# Altium project YatCPU.PrjPcb
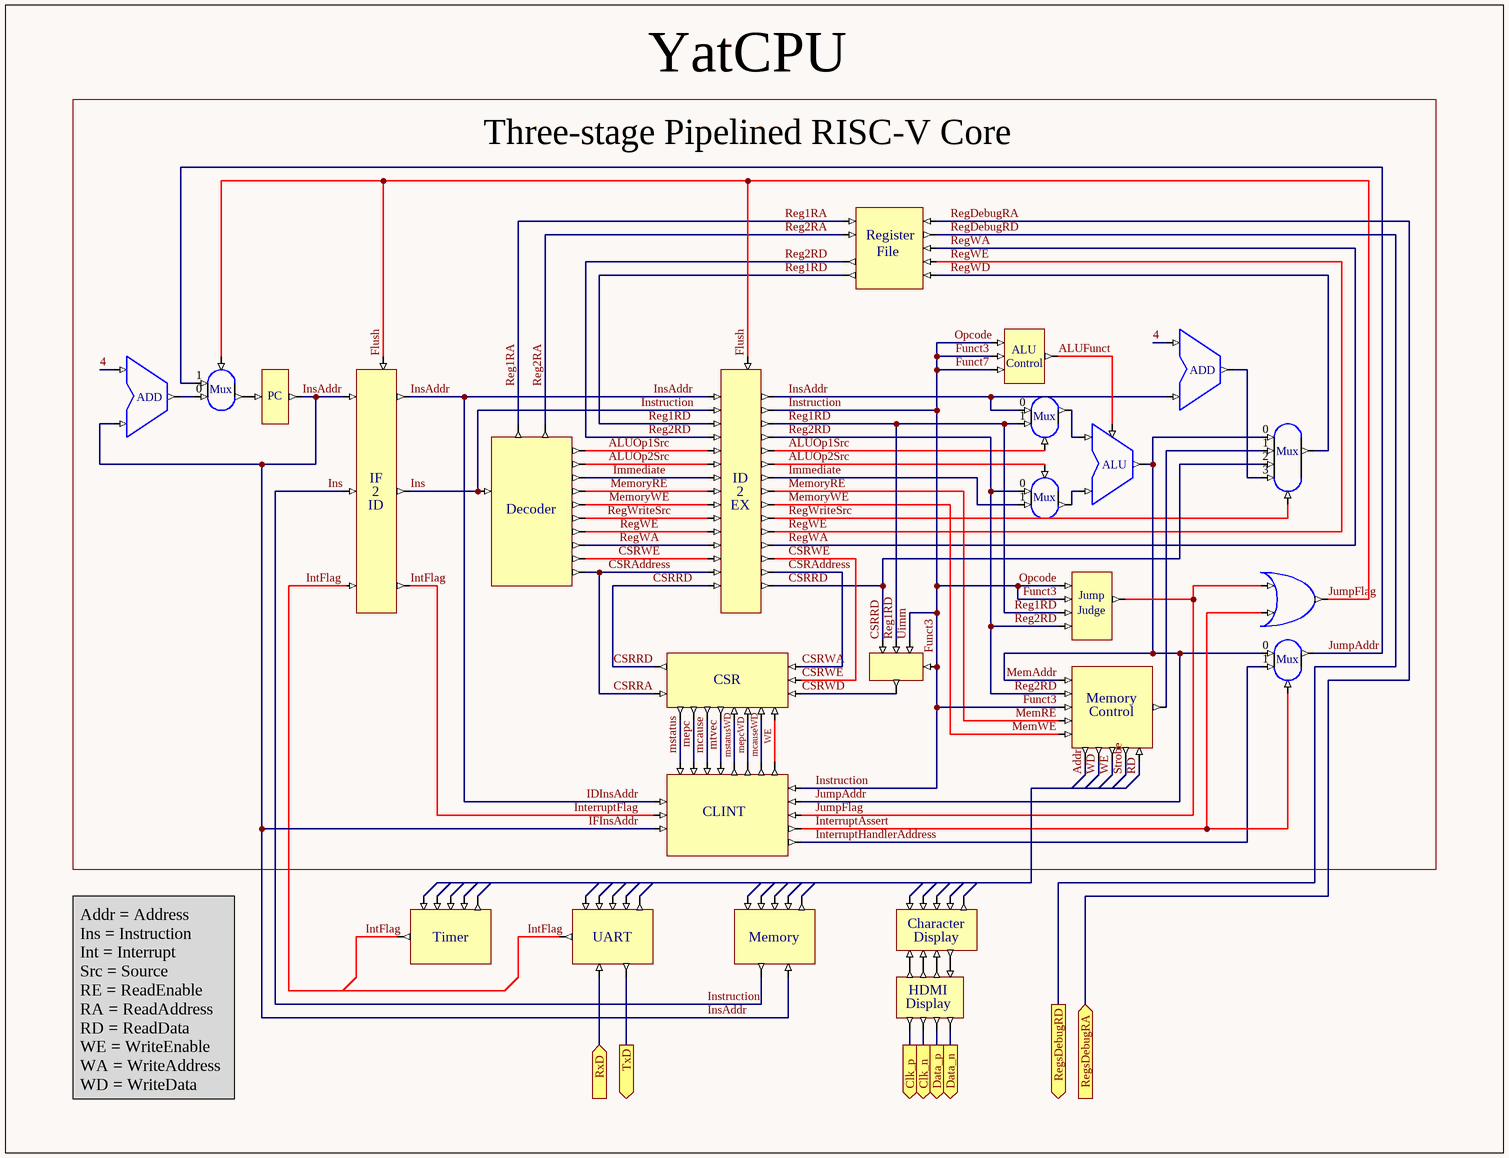
[diagram p0: ThreeStagePipelineCPU.SchDoc]
2 sheets, 54 parts. Net scope: flat (ports and power ports of the same name join across sheets).
Sheets:
  ThreeStagePipelineCPU.SchDoc
  FiveStagePipenlineCPU.SchDoc

## Sheet ThreeStagePipelineCPU.SchDoc
size 281 x 215 mm

### Parts
(Parts that share a designator on the sheet are numbered #1, #2 ... from top to bottom, then left to right.)
*#1  RegFile  (value not drawn)
*#2  ALUControl  (value not drawn)
*#3  ADD  (value not drawn)
*#4  ADD  (value not drawn)
*#5  Mux2  (value not drawn)
*#6  Mux2‘  (value not drawn)
*#7  ALU  (value not drawn)
*#8  Mux4  (value not drawn)
*#9  JumpJudge  (value not drawn)
*#10  OR  (value not drawn)
*#11  Mux2‘  (value not drawn)
*#12  CSR  (value not drawn)
*#13  CSRCompute  (value not drawn)
*#14  MemoryControl  (value not drawn)
*#15  CLINT  (value not drawn)
*#16  Timer  (value not drawn)
*#17  UART  (value not drawn)
*#18  Memory  (value not drawn)
*#19  CharacterDisplay  (value not drawn)
*#20  HDMIDisplay  (value not drawn)
*?#1  Mux2  (value not drawn)
ID  ID  (value not drawn)
ID/EX  PipelineReg14  (value not drawn)
IF/ID#1  PipelineReg3  (value not drawn)
Reg1  PC

### Blocks framed on the sheet
YatCPU: *#1-*#15 *?#1 ID ID/EX IF/ID#1 Reg1

### Ports
Clk_n (out), Clk_p (out), Data_n (out), Data_p (out), RegsDebugRA (in), RegsDebugRD (out), RxD (in), TxD (out)

### Nets
4: *#3.0(in0) *#4.0(in0)
Addr: *#14.10
ALUFunct: *#2.41 *#7.3
ALUOp1Src: *#6.3(select) ID.22 ID/EX.16 ID/EX.26
ALUOp2Src: *?#1.3(select) ID.14 ID/EX.17 ID/EX.27
CSRAddress: *#12.22 *#12.28 ID.23 ID/EX.6 ID/EX.34  [also labelled CSRWA]
CSRRD: *#8.2(in1) *#12.27 *#13.37 ID/EX.5(in) ID/EX.8
CSRWD: *#12.24 *#13.40
CSRWE: *#12.23 ID.21 ID/EX.11 ID/EX.33
Flush: *#5.3(select) *#9.40 *#10.1 *#10.3 *#15.23 ID/EX.10(FlushEnable) IF/ID#1.10  [also labelled JumpFlag]
Funct3: *#2.38 *#2.39 *#2.40 *#9.38 *#9.39 *#13.38 *#13.39 *#14.6 *#15.26 *#18.45 ID.11 ID/EX.13 ID/EX.23 IF/ID#1.3(in) IF/ID#1.7  [also labelled Funct7, Ins, Instruction, Opcode, Uimm]
IDInsAddr: *#3.1(in1) *#4.1(in1) *#6.0(in0) *#15.27 *#15.28 *#18.46 ID/EX.2(in) ID/EX.12 IF/ID#1.2(in) IF/ID#1.6 Reg1.1(OUT)  [also labelled IFInsAddr, InsAddr]
Immediate: *?#1.1(in1) ID.15 ID/EX.18 ID/EX.28
InterruptAssert: *#10.2 *#11.3(select) *#15.24
InterruptFlag: *#15.29 IF/ID#1.8  [also labelled IntFlag]
InterruptHandlerAddress: *#11.1(in1) *#15.25
JumpAddr: *#5.1(in0) *#7.2(out) *#8.0(in0) *#11.0(in0) *#11.2(out) *#14.4 *#15.22  [also labelled MemAddr]
mcause: *#12.30 *#15.16
mcauseWD: *#12.34 *#15.20
MemoryRE: *#14.7 ID.16 ID/EX.3(in) ID/EX.7  [also labelled MemRE]
MemoryWE: *#14.8 ID.17 ID/EX.19 ID/EX.29  [also labelled MemWE]
mepc: *#12.29 *#15.15
mepcWD: *#12.33 *#15.19
mstatus: *#12.29 *#15.15
mstatusWD: *#12.32 *#15.18
mtvec: *#12.31 *#15.17
RD: *#14.13
Reg1RA: *#1.28 ID.12
Reg1RD: *#1.31 *#6.1(in1) *#9.36 *#13.36 ID/EX.14 ID/EX.24
Reg2RA: *#1.29 ID.13
Reg2RD: *#1.30 *#9.37 *#14.5 *?#1.0(in0) ID/EX.15 ID/EX.25
RegDebugRA: *#1.35 ; port RegsDebugRA
RegDebugRD: *#1.36 ; port RegsDebugRD
RegWA: *#1.32 ID.20 ID/EX.22 ID/EX.32
RegWD: *#1.34 *#8.4(out)
RegWE: *#1.33 ID.19 ID/EX.21 ID/EX.31
RegWriteSrc: *#8.5(select) ID.18 ID/EX.20 ID/EX.30
Strobe: *#14.11
WD: *#14.14
WE: *#12.35 *#14.12 *#15.21
Net*#3_2: *#3.2(out) *#8.3(in3)
Net*#4_2: *#4.2(out) *#5.0(in1)
Net*#5_2: *#5.2(out) Reg1.0(IN)
Net*#6_2: *#6.2(out) *#7.0(in0)
Net*#7_1: *#7.1(in1) *?#1.2(out)
Net*#8_1: *#8.1(in1) *#14.9
Net*#17_46: *#17.46 ; port RxD
Net*#17_47: *#17.47 ; port TxD
Net*#19_45: *#19.45 *#20.44
Net*#19_46: *#19.46 *#20.43
Net*#19_47: *#19.47 *#20.43
Net*#19_48: *#19.48 *#20.43
Net*#20_45: *#20.45 ; port Data_n
Net*#20_46: *#20.46 ; port Clk_p
Net*#20_47: *#20.47 ; port Clk_n
Net*#20_48: *#20.48 ; port Data_p

Not connected (* = marked no-connect by the designer): *#16 43 44 45; *#17 43 44 45; *#18 43 44; *#19 43 44; IF/ID#1 5(in)

### Buses and harness runs
bus IntFlag

### Notes on the sheet
- Three-stage Pipelined RISC-V Core
- Addr = Address
  Ins = Instruction
  Int = Interrupt
  Src = Source
  RE = ReadEnable
  RA = ReadAddress
  RD = ReadData
  WE = WriteEnable
  WA = WriteAddress
  WD = WriteData
- Labels drawn without touching a wire or pin: CSRRA, CSRRD, Ins, IntFlag, Opcode
- (in symbol ALUControl) ALU; Control
- (in symbol CharacterDisplay) Character; Display
- (in symbol HDMIDisplay) HDMI; Display
- (in symbol ID) Decoder
- (in symbol JumpJudge) Jump; Judge
- (in symbol MemoryControl) Memory; Control
- (in symbol Mux2) Mux
- (in symbol Mux2‘) Mux
- (in symbol Mux4) Mux
- (in symbol PipelineReg3) IF; ID
- (in symbol PipelineReg14) ID; EX
- (in symbol RegFile) Register; File

### Library data of the parts
Reg1 = Reg

## Sheet FiveStagePipenlineCPU.SchDoc
size 347 x 254 mm
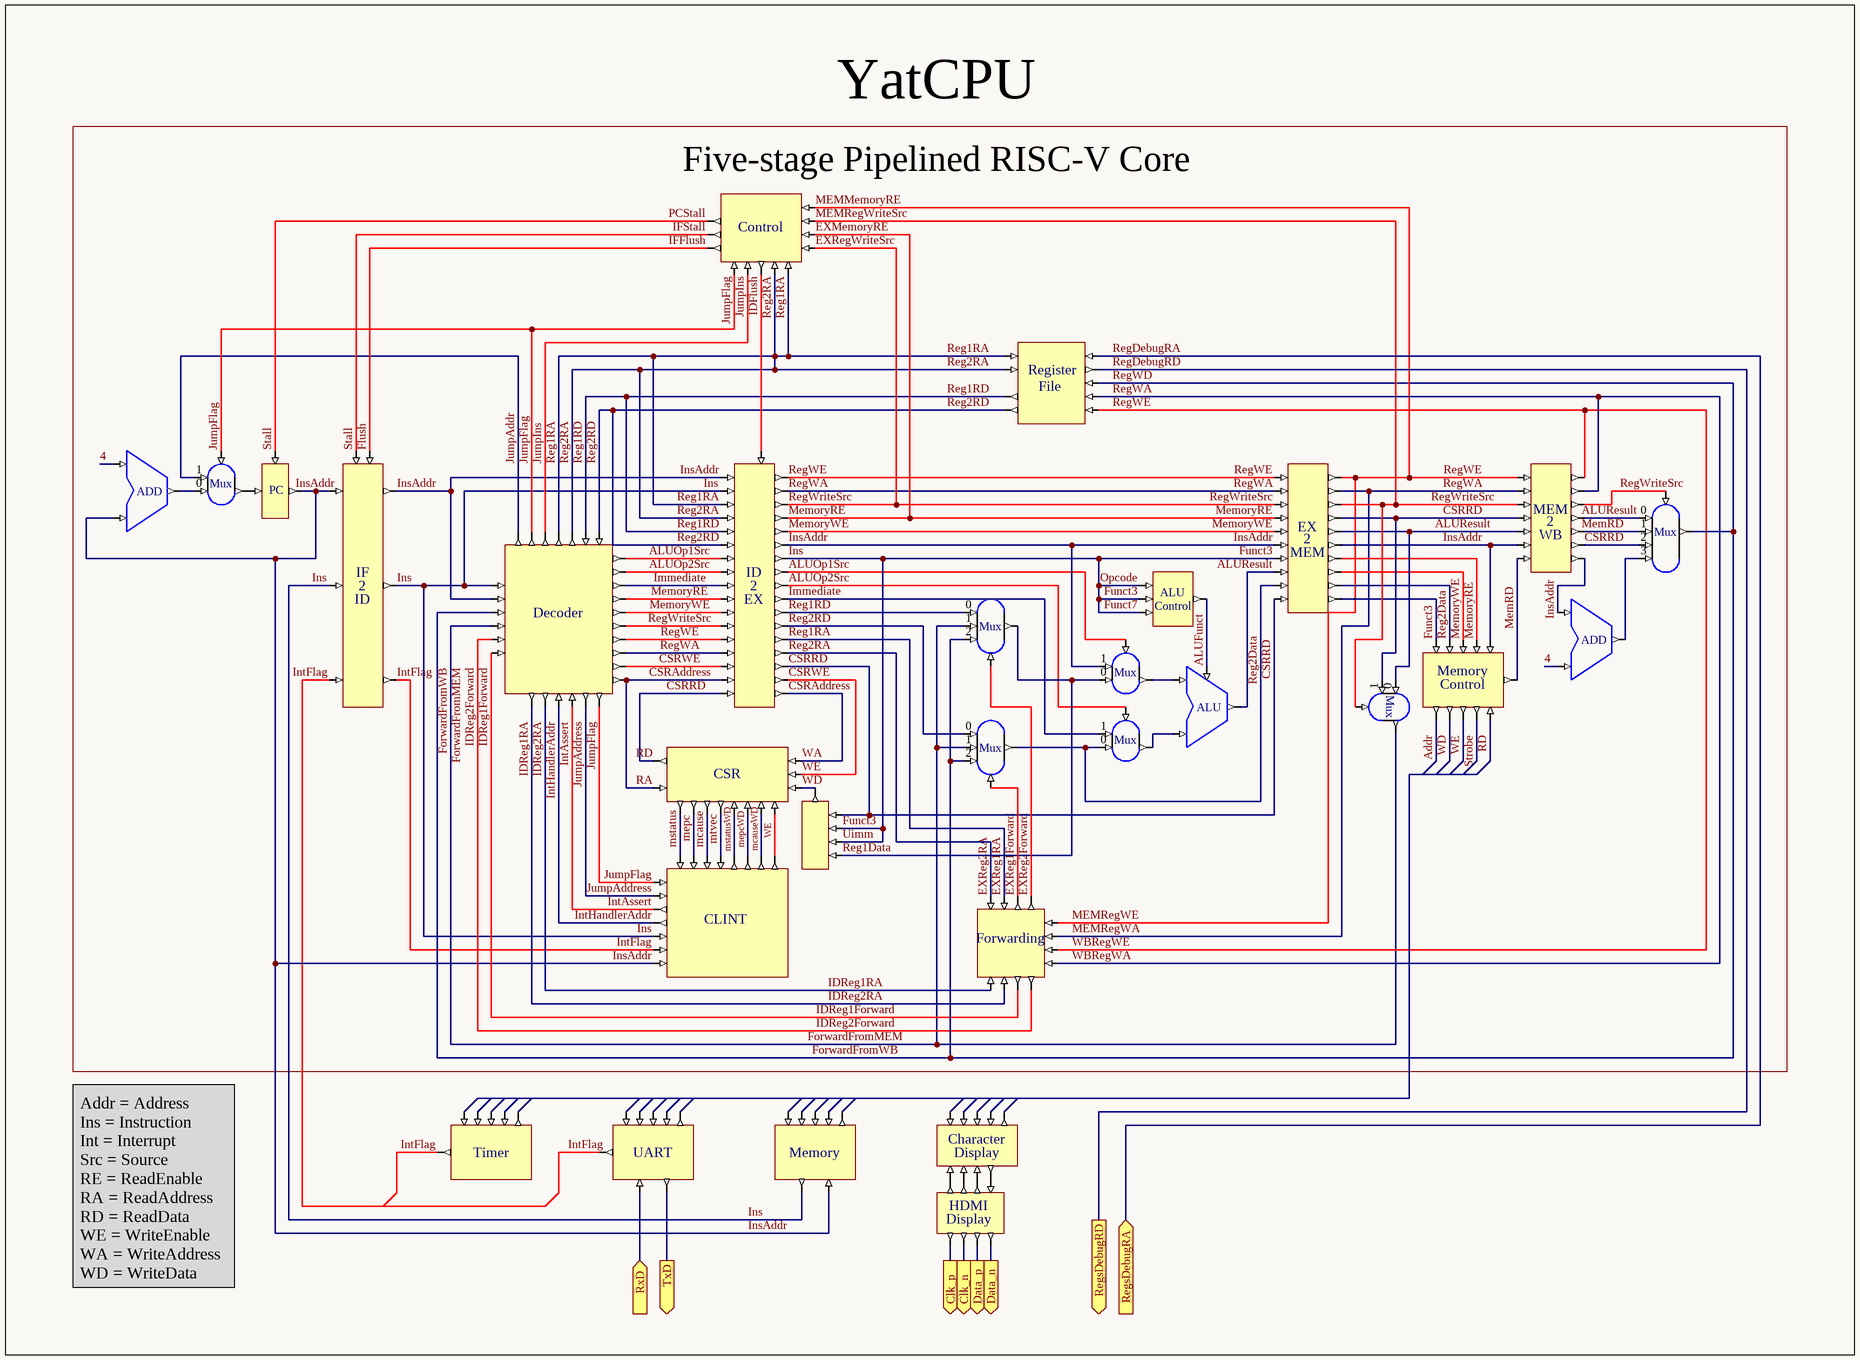
[diagram p1: FiveStagePipenlineCPU.SchDoc]

### Parts
(Parts that share a designator on the sheet are numbered #1, #2 ... from top to bottom, then left to right.)
*#21  Control  (value not drawn)
*#22  PipelineReg16  (value not drawn)
*#23  PC
*#24  PipelineReg7  (value not drawn)
*#25  ID_1  (value not drawn)
*#26  ALUControl  (value not drawn)
*#27  Mux3_1  (value not drawn)
*#28  MemoryControl_1  (value not drawn)
*#29  ALU  (value not drawn)
*#30  Mux2‘  (value not drawn)
*#31  Mux3_1  (value not drawn)
*#32  Mux2  (value not drawn)
*#33  CSRCompute_1  (value not drawn)
*#34  CLINT_1  (value not drawn)
*#35  Forwarding  (value not drawn)
*?#2  RegFile  (value not drawn)
*?#3  ADD  (value not drawn)
*?#4  Mux2  (value not drawn)
*?#5  Mux4  (value not drawn)
*?#6  ADD  (value not drawn)
*?#7  Mux2  (value not drawn)
*?#8  CSR  (value not drawn)
*?#9  Timer  (value not drawn)
*?#10  UART  (value not drawn)
*?#11  Memory  (value not drawn)
*?#12  CharacterDisplay  (value not drawn)
*?#13  HDMIDisplay  (value not drawn)
EX/MEM  PipelineReg10  (value not drawn)
IF/ID#2  PipelineReg3  (value not drawn)

### Blocks framed on the sheet
YatCPU: *#21-*#35 *?#2-*?#8 EX/MEM IF/ID#2

### Ports
Clk_n (out), Clk_p (out), Data_n (out), Data_p (out), RegsDebugRA (in), RegsDebugRD (out), RxD (in), TxD (out)

### Nets
4: *?#3.0(in0) *?#6.1(in1)
Addr: *#28.10
ALUFunct: *#26.41 *#29.3
ALUOp1Src: *#22.18 *#22.27 *#25.22 *?#7.3(select)
ALUOp2Src: *#22.7 *#22.28 *#25.14 *#32.3(select)
ALUResult: *#24.15 *#24.26 *#29.2(out) *#30.0(in0) *?#5.0(in0) EX/MEM.3(in) EX/MEM.16
CSRAddress: *#22.5(in) *#22.36 *#25.23 *?#8.22 *?#8.28  [also labelled WA]
CSRRD: *#22.6 *#22.38 *#24.17 *#24.25 *#30.1(in1) *#33.37 *?#5.2(in1) *?#8.27 EX/MEM.15 EX/MEM.30
CSRWE: *#22.8 *#22.34 *#25.21 *#28.12 *#34.21 *?#8.23 *?#8.35  [also labelled WE]
EXMemoryRE: *#21.56 *#22.14 *#22.29 *#25.16 *#28.5 EX/MEM.18 EX/MEM.25  [also labelled MemoryRE]
EXReg1Forward: *#31.4(select) *#35.42
EXReg1RA: *#21.61 *#21.62 *#22.11 *#22.22 *#22.23 *#22.24 *#25.13 *#25.35 *#35.44 *#35.45 *?#2.28 *?#2.29  [also labelled EXReg2RA, Reg1RA, Reg2RA]
EXReg2Forward: *#27.4(select) *#35.43
EXRegWriteSrc: *#21.54 *#21.57 *#22.13 *#22.31 *#24.14 *#24.24 *#25.18 *#30.3(select) *?#5.5(select) EX/MEM.14 EX/MEM.24  [also labelled MEMRegWriteSrc, RegWriteSrc]
Flush: *#21.52 IF/ID#2.10  [also labelled IFFlush]
ForwardFromMEM: *#25.11 *#25.27 *#27.1(in1) *#27.2(in2) *#30.2(out) *#31.1(in1) *#31.2(in2) *?#2.32 *?#5.4(out)  [also labelled ForwardFromWB, RegWD]
Funct3: *#22.2(in) *#22.17 *#25.25 *#26.38 *#26.39 *#26.40 *#28.8 *#33.36 *#33.38 *#34.25 *?#11.45 EX/MEM.20 EX/MEM.28 IF/ID#2.3(in) IF/ID#2.7  [also labelled Funct7, Ins, Opcode, Uimm]
IDFlush: *#21.60 *#22.10(FlushEnable)
IDReg1Forward: *#25.29 *#35.48
IDReg1RA: *#25.39 *#25.40 *#35.46 *#35.47  [also labelled IDReg2RA]
IDReg2Forward: *#25.28 *#35.49
IFStall: *#21.50 *#21.51 *#23.2(EN) IF/ID#2.9(WriteEnable)  [also labelled PCStall, Stall]
Immediate: *#22.3(in) *#22.19 *#25.15 *#32.1(in1)
InsAddr: *#22.16 *#22.37 *#23.1(OUT) *#24.18 *#24.27 *#25.26 *#28.4 *#34.26 *?#3.1(in1) *?#6.0(in0) *?#7.1(in1) *?#11.46 EX/MEM.17 EX/MEM.27 IF/ID#2.2(in) IF/ID#2.6
IntAssert: *#25.32 *#34.23
IntFlag: *#34.28 *?#9.45 IF/ID#2.8
IntHandlerAddr: *#25.31 *#34.24
JumpAddr: *#25.41 *?#4.1(in0)
JumpAddress: *#25.33 *#34.22
JumpFlag: *#21.58 *#25.34 *#25.38 *#34.27 *?#4.3(select)
JumpIns: *#21.59 *#25.12
mcause: *#34.16 *?#8.30
mcauseWD: *#34.20 *?#8.34
MEMMemoryRE: *#21.53 *#22.32 *#22.35 *#24.2(in) *#24.12 *#25.19 *#35.39 *#35.41 *?#2.34 EX/MEM.2(in) EX/MEM.12  [also labelled MEMRegWE, RegWE, WBRegWE]
MemoryWE: *#22.15 *#22.30 *#25.17 *#28.6 EX/MEM.7 EX/MEM.26
MemRD: *#24.16 *#24.28 *#28.9 *?#5.1(in1)
MEMRegWA: *#22.12 *#22.33 *#24.13 *#24.23 *#25.20 *#35.40 *#35.50 *?#2.33 EX/MEM.13 EX/MEM.23  [also labelled RegWA, WBRegWA]
mepc: *#34.15 *?#8.29
mepcWD: *#34.19 *?#8.33
mstatus: *#34.15 *?#8.29
mstatusWD: *#34.18 *?#8.32
mtvec: *#34.17 *?#8.31
RD: *#28.13
Reg1Data: *#27.3(out) *#33.40 *?#7.0(in0)
Reg1RD: *#22.20 *#22.25 *#25.36 *#27.0(in0) *?#2.30
Reg2Data: *#28.7 *#31.3(out) *#32.0(in0) EX/MEM.19 EX/MEM.29
Reg2RD: *#22.21 *#22.26 *#25.37 *#31.0(in0) *?#2.31
RegDebugRA: *?#2.35 ; port RegsDebugRA
RegDebugRD: *?#2.36 ; port RegsDebugRD
Strobe: *#28.11
WD: *#28.14 *#33.39 *?#8.24
Net*#17_46: *?#10.46 ; port RxD
Net*#17_47: *?#10.47 ; port TxD
Net*#20_45: *?#13.45 ; port Data_n
Net*#20_46: *?#13.46 ; port Clk_p
Net*#20_47: *?#13.47 ; port Clk_n
Net*#20_48: *?#13.48 ; port Data_p
Net*#23_0: *#23.0(IN) *?#4.2(out)
Net*#29_0: *#29.0(in0) *?#7.2(out)
Net*#29_1: *#29.1(in1) *#32.2(out)
Net*?#3_2: *?#3.2(out) *?#4.0(in1)
Net*?#5_3: *?#5.3(in3) *?#6.2(out)
Net*?#12_45: *?#12.45 *?#13.44
Net*?#12_46: *?#12.46 *?#13.43
Net*?#12_47: *?#12.47 *?#13.43
Net*?#12_48: *?#12.48 *?#13.43

Not connected (* = marked no-connect by the designer): *?#9 43 44; *?#10 43 44 45; *?#11 43 44; *?#12 43 44; IF/ID#2 5(in)

### Buses and harness runs
bus IntFlag

### Notes on the sheet
- (near *#21) Five-stage Pipelined RISC-V Core
- Addr = Address
  Ins = Instruction
  Int = Interrupt
  Src = Source
  RE = ReadEnable
  RA = ReadAddress
  RD = ReadData
  WE = WriteEnable
  WA = WriteAddress
  WD = WriteData
- Labels drawn without touching a wire or pin: ForwardFromMEM, IntFlag, RA, RD
- (in symbol ALUControl) ALU; Control
- (in symbol CharacterDisplay) Character; Display
- (in symbol CLINT_1) CLINT
- (in symbol HDMIDisplay) HDMI; Display
- (in symbol ID_1) Decoder
- (in symbol MemoryControl_1) Memory; Control
- (in symbol Mux2) Mux
- (in symbol Mux2‘) Mux
- (in symbol Mux3_1) Mux
- (in symbol Mux4) Mux
- (in symbol PipelineReg3) IF; ID
- (in symbol PipelineReg7) MEM; WB
- (in symbol PipelineReg10) EX; MEM
- (in symbol PipelineReg16) ID; EX
- (in symbol RegFile) Register; File

### Library data of the parts
*#23 = Reg

## Nets that join several sheets
Net*#17_46: ThreeStagePipelineCPU (*#17.46), FiveStagePipenlineCPU (*?#10.46)
Net*#17_47: ThreeStagePipelineCPU (*#17.47), FiveStagePipenlineCPU (*?#10.47)
Net*#20_45: ThreeStagePipelineCPU (*#20.45), FiveStagePipenlineCPU (*?#13.45)
Net*#20_46: ThreeStagePipelineCPU (*#20.46), FiveStagePipenlineCPU (*?#13.46)
Net*#20_47: ThreeStagePipelineCPU (*#20.47), FiveStagePipenlineCPU (*?#13.47)
Net*#20_48: ThreeStagePipelineCPU (*#20.48), FiveStagePipenlineCPU (*?#13.48)
RegDebugRA: ThreeStagePipelineCPU (*#1.35), FiveStagePipenlineCPU (*?#2.35)
RegDebugRD: ThreeStagePipelineCPU (*#1.36), FiveStagePipenlineCPU (*?#2.36)